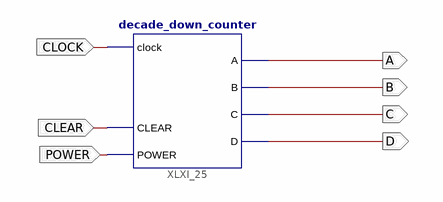
[diagram p0: schematic sheet 1]
// Xilinx ISE schematic Contador.sch (spartan3) as structural Verilog: 1 symbols, 7 ports
module Contador (
  input  CLOCK,
  input  CLEAR,
  input  POWER,
  output A,
  output B,
  output C,
  output D
);

  decade_down_counter XLXI_25 (.clock(CLOCK), .CLEAR(CLEAR), .POWER(POWER), .A(A), .B(B), .C(C), .D(D));
endmodule
